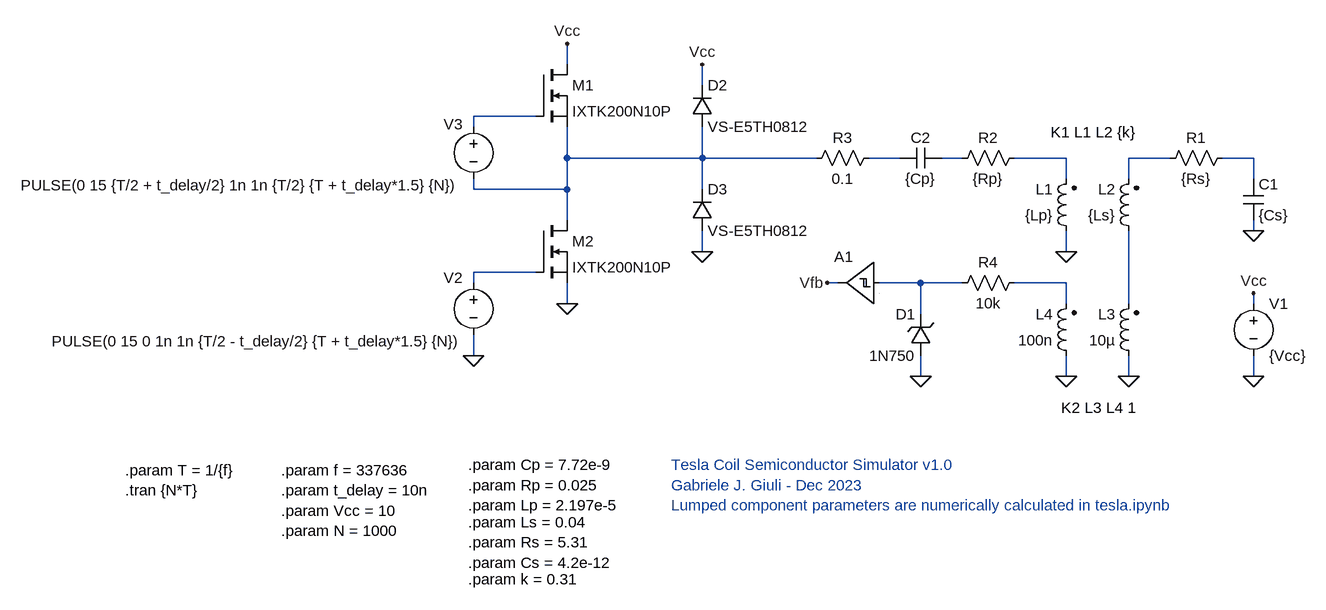
[diagram p0: schematic spice_model.asc]
spice_model.asc, the LTspice schematic file:
Version 4
SHEET 1 1512 784
WIRE 352 -192 352 -224
WIRE 560 -160 560 -192
WIRE 304 -112 208 -112
WIRE 208 -96 208 -112
WIRE 352 -48 352 -96
WIRE 560 -48 560 -96
WIRE 560 -48 352 -48
WIRE 736 -48 560 -48
WIRE 864 -48 816 -48
WIRE 960 -48 928 -48
WIRE 1120 -48 1040 -48
WIRE 1280 -48 1216 -48
WIRE 1408 -48 1360 -48
WIRE 1120 -16 1120 -48
WIRE 1216 -16 1216 -48
WIRE 1408 -16 1408 -48
WIRE 208 0 208 -16
WIRE 352 0 352 -48
WIRE 352 0 208 0
WIRE 560 0 560 -48
WIRE 352 48 352 0
WIRE 1408 64 1408 48
WIRE 560 96 560 64
WIRE 1120 96 1120 64
WIRE 304 128 208 128
WIRE 208 144 208 128
WIRE 768 144 752 144
WIRE 896 144 832 144
WIRE 960 144 896 144
WIRE 1120 144 1040 144
WIRE 352 176 352 144
WIRE 1120 176 1120 144
WIRE 1216 176 1216 64
WIRE 1408 176 1408 160
WIRE 896 192 896 144
WIRE 208 256 208 224
WIRE 896 288 896 256
WIRE 1120 288 1120 256
WIRE 1216 288 1216 256
WIRE 1408 288 1408 256
FLAG 1120 96 0
FLAG 1216 288 0
FLAG 1408 64 0
FLAG 208 256 0
FLAG 352 176 0
FLAG 352 -224 Vcc
FLAG 1408 288 0
FLAG 1408 160 Vcc
FLAG 1120 288 0
FLAG 896 288 0
FLAG 752 144 Vfb
FLAG 560 -192 Vcc
FLAG 560 96 0
SYMBOL ind2 1136 80 R180
WINDOW 0 36 80 Left 2
WINDOW 3 36 40 Left 2
SYMATTR InstName L1
SYMATTR Value {Lp}
SYMBOL ind2 1232 80 R180
WINDOW 0 36 80 Left 2
WINDOW 3 36 40 Left 2
SYMATTR InstName L2
SYMATTR Value {Ls}
SYMBOL cap 1392 -16 R0
SYMATTR InstName C1
SYMATTR Value {Cs}
SYMBOL Res 1376 -64 R90
WINDOW 0 0 56 VBottom 2
WINDOW 3 32 56 VTop 2
SYMATTR InstName R1
SYMATTR Value {Rs}
SYMBOL Res 1056 -64 R90
WINDOW 0 0 56 VBottom 2
WINDOW 3 32 56 VTop 2
SYMATTR InstName R2
SYMATTR Value {Rp}
SYMBOL cap 928 -64 R90
WINDOW 0 0 32 VBottom 2
WINDOW 3 32 32 VTop 2
SYMATTR InstName C2
SYMATTR Value {Cp}
SYMBOL voltage 208 128 R0
WINDOW 0 -46 8 Left 2
WINDOW 3 -14 106 Right 2
SYMATTR InstName V2
SYMATTR Value PULSE(0 15 0 1n 1n {T/2 - t_delay/2} {T + t_delay*1.5} {N})
SYMBOL voltage 208 -112 R0
WINDOW 0 -46 12 Left 2
WINDOW 3 -17 106 Right 2
SYMATTR InstName V3
SYMATTR Value PULSE(0 15 {T/2 + t_delay/2} 1n 1n {T/2} {T + t_delay*1.5} {N})
SYMBOL nmos 304 -192 R0
SYMATTR InstName M1
SYMATTR Value IXTK200N10P
SYMBOL nmos 304 48 R0
SYMATTR InstName M2
SYMATTR Value IXTK200N10P
SYMBOL voltage 1408 160 R0
SYMATTR InstName V1
SYMATTR Value {Vcc}
SYMBOL Res 832 -64 R90
WINDOW 0 0 56 VBottom 2
WINDOW 3 32 56 VTop 2
SYMATTR InstName R3
SYMATTR Value 0.1
SYMBOL ind2 1232 272 R180
WINDOW 0 36 80 Left 2
WINDOW 3 36 40 Left 2
SYMATTR InstName L3
SYMATTR Value 10µ
SYMBOL ind2 1136 272 R180
WINDOW 0 36 80 Left 2
WINDOW 3 36 40 Left 2
SYMATTR InstName L4
SYMATTR Value 100n
SYMBOL zener 912 256 R180
WINDOW 0 24 64 Left 2
WINDOW 3 24 0 Left 2
SYMATTR InstName D1
SYMATTR Value 1N750
SYMBOL Res 1056 128 R90
WINDOW 0 0 56 VBottom 2
WINDOW 3 32 56 VTop 2
SYMATTR InstName R4
SYMATTR Value 10k
SYMBOL Digital/schmtbuf 832 80 M0
SYMATTR InstName A1
SYMBOL diode 544 -96 M180
WINDOW 0 24 64 Left 2
WINDOW 3 24 0 Left 2
SYMATTR InstName D2
SYMATTR Value VS-E5TH0812
SYMBOL diode 544 64 M180
WINDOW 0 24 64 Left 2
WINDOW 3 24 0 Left 2
SYMATTR InstName D3
SYMATTR Value VS-E5TH0812
TEXT 1096 -88 Left 2 !K1 L1 L2 {k}
TEXT -328 432 Left 2 !.param T = 1/{f}\n.tran {N*T}
TEXT -88 432 Left 2 !.param f = 337636\n.param t_delay = 10n\n.param Vcc = 10\n.param N = 1000
TEXT 1112 336 Left 2 !K2 L3 L4 1
TEXT 200 424 Left 2 !.param Cp = 7.72e-9\n.param Rp = 0.025\n.param Lp = 2.197e-5
TEXT 200 512 Left 2 !.param Ls = 0.04\n.param Rs = 5.31\n.param Cs = 4.2e-12
TEXT 200 600 Left 2 !.param k = 0.31
TEXT 512 424 Left 2 ;Tesla Coil Semiconductor Simulator v1.0\nGabriele J. Giuli - Dec 2023\nLumped component parameters are numerically calculated in tesla.ipynb

The netlist it stands for:
* spice_model.asc
L1 0 N005 {Lp}
L2 N011 N006 {Ls}
C1 N007 0 {Cs}
R1 N007 N006 {Rs}
R2 N005 N004 {Rp}
C2 N004 N003 {Cp}
V2 N008 0 PULSE(0 15 0 1n 1n {T/2 - t_delay/2} {T + t_delay*1.5} {N})
V3 N001 N002 PULSE(0 15 {T/2 + t_delay/2} 1n 1n {T/2} {T + t_delay*1.5} {N})
M1 Vcc N001 N002 N002 IXTK200N10P
M2 N002 N008 0 0 IXTK200N10P
V1 Vcc 0 {Vcc}
R3 N003 N002 0.1
L3 0 N011 10µ
L4 0 N010 100n
D1 0 N009 1N750
R4 N010 N009 10k
A1 N009 0 0 0 0 0 Vfb 0 SCHMITT
D2 N002 Vcc VS-E5TH0812
D3 0 N002 VS-E5TH0812
.model D D
.lib standard.dio
.model NMOS NMOS
.model PMOS PMOS
.lib standard.mos
K1 L1 L2 {k}
.param T = 1/{f}
.tran {N*T}
.param f = 337636
.param t_delay = 10n
.param Vcc = 10
.param N = 1000
K2 L3 L4 1
.param Cp = 7.72e-9
.param Rp = 0.025
.param Lp = 2.197e-5
.param Ls = 0.04
.param Rs = 5.31
.param Cs = 4.2e-12
.param k = 0.31
* Tesla Coil Semiconductor Simulator v1.0
* Gabriele J. Giuli - Dec 2023
* Lumped component parameters are numerically calculated in tesla.ipynb
.backanno
.end